# Altium schematic sheet red.SchDoc
size A
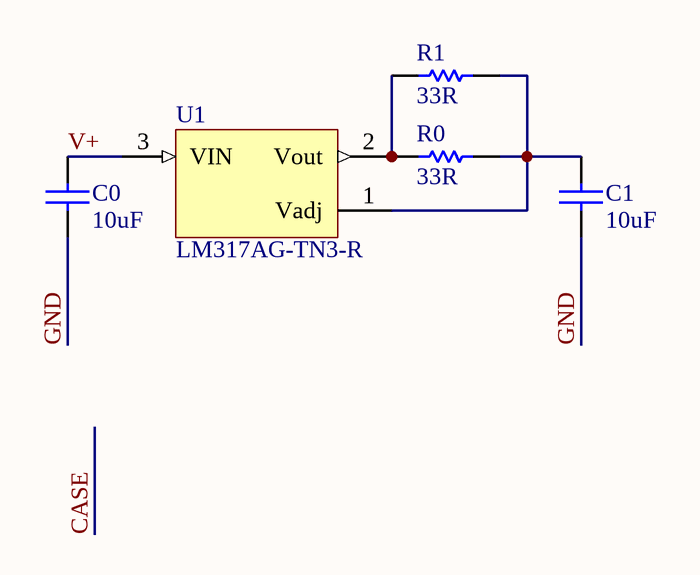
[diagram p0: red.SchDoc]

## Parts
C0  value 10uF  [C_0805]  (hidden comment: CL21A106KAYNNNE)
C1  value 10uF  [C_0805]  (hidden comment: CL21A106KAYNNNE)
R0  value 33R  [R_0805]  (hidden comment: 0805W8F330JT5E)
R1  value 33R  [R_0805]  (hidden comment: 0805W8F330JT5E)
U1  LM317AG-TN3-R  [TO-252AA]

## Nets
GND: C0.1 C1.1
V+: C0.2 U1.3(VIN)
NetC1_2: C1.2 R0.2 R1.2 U1.1(Vadj)
NetR0_1: R0.1 R1.1 U1.2(Vout)

## Library data of the parts
C0 C1 = CL21A106KAYNNNE: C - CAPACITOR - MLCC - 10uF - 25V - 0805; WVDC: 25; LCSC Part #: C15850; Availability: Basic
R0 R1 = 0805W8F330JT5E: R - RESISTOR - SMD - 33R - 1% - 0402; LCSC Part #: C17634; JLC Availability: Basic
U1 = LM317AG-TN3-R: U - IC - ADJUSTABLE LDO; VOut: ADJ; LCSC Part #: C75510; JLC Availability: Basic